# EAGLE schematic mini_robot (EAGLE 9.0.0)
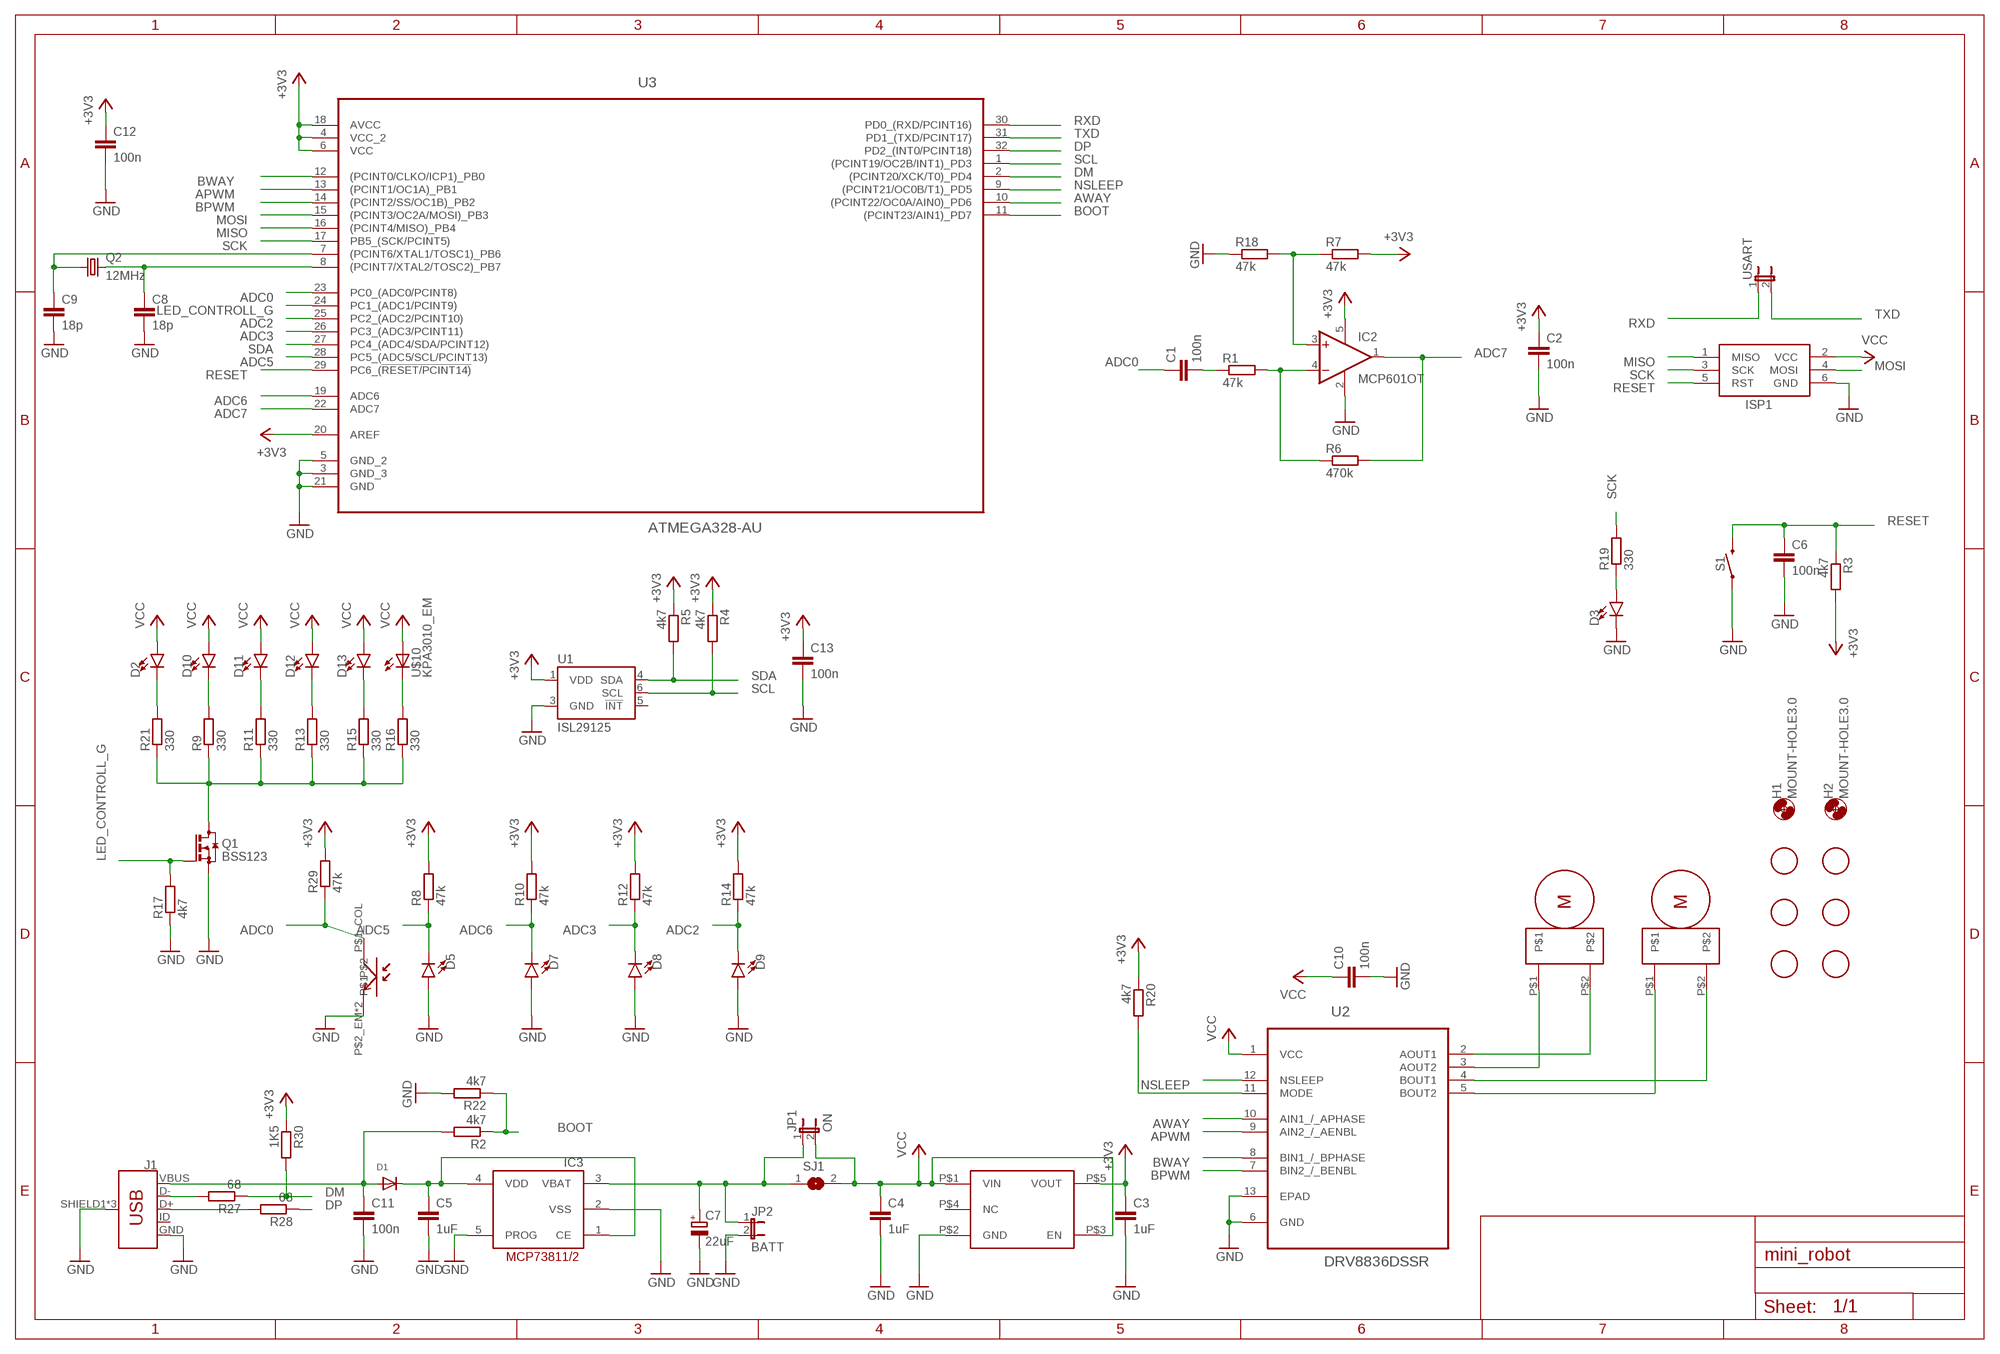
[diagram p0: schematic, sheet 1]

## Parts
C1  100n  C-EUC0603  [C0603]
C2  100n  C-EUC0603  [C0603]
C3  1uF  C-EUC0805  [C0805]
C4  1uF  C-EUC0805  [C0805]
C5  1uF  C-EUC0603  [C0603]
C6  100n  C-EUC0603  [C0603]
C7  22uF  CPOL-EU153CLV-0505  [153CLV-0505]
C8  18p  C-EUC0603  [C0603]
C9  18p  C-EUC0603  [C0603]
C10  100n  C-EUC0603  [C0603]
C11  100n  C-EUC0603  [C0603]
C12  100n  C-EUC0603  [C0603]
C13  100n  C-EUC0603  [C0603]
D1  DIODE_SOD-123FL  [SOD-123FL]
D2  LED-FKIT-1206  [FKIT-LED-1206]
D3  LED-FKIT-1206  [FKIT-LED-1206]
D5  LED-FKIT-1206  [FKIT-LED-1206]
D7  LED-FKIT-1206  [FKIT-LED-1206]
D8  LED-FKIT-1206  [FKIT-LED-1206]
D9  LED-FKIT-1206  [FKIT-LED-1206]
D10  LED-FKIT-1206  [FKIT-LED-1206]
D11  LED-FKIT-1206  [FKIT-LED-1206]
D12  LED-FKIT-1206  [FKIT-LED-1206]
D13  LED-FKIT-1206  [FKIT-LED-1206]
H1  MOUNT-HOLE3.0  [3,0]
H2  MOUNT-HOLE3.0  [3,0]
IC2  MCP601OT  [SOT23-5]
IC3  MCP73811/2  [SOT23-5L]
ISP1  AVRISP-6  [AVRISP]
J1  USB_MICRO-B_FEMALE-SMT  [USB-B-MICRO-SMD]
JP1  ON  JP1E  [JP1]
JP2  BATT  JP1E  [JP1]
Q1  BSS123  [SOT23]
Q2  12MHz  CRYSTALCTS406  [CTS406]
R1  47k  R-EU_R0603  [R0603]
R2  4k7  R-EU_R0603  [R0603]
R3  4k7  R-EU_R0603  [R0603]
R4  4k7  R-EU_R0603  [R0603]
R5  4k7  R-EU_R0603  [R0603]
R6  470k  R-EU_R0603  [R0603]
R7  47k  R-EU_R0603  [R0603]
R8  47k  R-EU_R0603  [R0603]
R9  330  R-EU_R0603  [R0603]
R10  47k  R-EU_R0603  [R0603]
R11  330  R-EU_R0603  [R0603]
R12  47k  R-EU_R0603  [R0603]
R13  330  R-EU_R0603  [R0603]
R14  47k  R-EU_R0603  [R0603]
R15  330  R-EU_R0603  [R0603]
R16  330  R-EU_R0603  [R0603]
R17  4k7  R-EU_R0603  [R0603]
R18  47k  R-EU_R0603  [R0603]
R19  330  R-EU_R0603  [R0603]
R20  4k7  R-EU_R0603  [R0603]
R21  330  R-EU_R0603  [R0603]
R22  4k7  R-EU_R0603  [R0603]
R27  68  R-EU_R0603  [R0603]
R28  68  R-EU_R0603  [R0603]
R29  47k  R-EU_R0603  [R0603]
R30  1K5  R-EU_R0603  [R0603]
S1  MOMENTARY-SWITCH-SPST-SMD-6.2MM-TALL  [TACTILE_SWITCH_SMD_6.2MM_TALL]
SJ1  SJ  [SJ]
U1  ISL29125  [ODFN-LD-6]
U2  DRV8836DSSR  [SON50P200X300X80-13N]
U3  ATMEGA328-AU  [QFP80P900X900X120-32N]
U$1  FIDUCIAL  [FIDUCIAL_1MM]
U$2  KPA3010  [KPA3010]
U$3  FIDUCIAL  [FIDUCIAL_1MM]
U$4  FIDUCIAL  [FIDUCIAL_1MM]
U$5  FIDUCIAL  [FIDUCIAL_1MM]
U$6  FIDUCIAL  [FIDUCIAL_1MM]
U$7  FIDUCIAL  [FIDUCIAL_1MM]
U$8  PLANETARY_GEAR_MOTOR  [PLANETARY_GEAR_MOTOR]
U$9  PLANETARY_GEAR_MOTOR  [PLANETARY_GEAR_MOTOR]
U$10  KPA3010_EM  [KPA3010]
U$11  MIC5504-3.3Y  [SOT23-5]
USART  JP1E  [JP1]

## Nets
+3V3: C2.1 C3.1 C12.1 C13.1 IC2.5(V+) R3.2 R4.1 R5.1 R7.2 R8.2 R10.2 R12.2 R14.2 R20.1 R29.2 R30.1 U1.1(VDD) U3.4(VCC_2) U3.6(VCC) U3.18(AVCC) U3.20(AREF) U$11.P$5(VOUT)
ADC0: C1.1 R29.1 U3.23(PC0_(ADC0/PCINT8)) U$2.P$1_COL
ADC2: D9.C R14.1 U3.25(PC2_(ADC2/PCINT10))
ADC3: D8.C R12.1 U3.26(PC3_(ADC3/PCINT11))
ADC5: D5.C R8.1 U3.28(PC5_(ADC5/SCL/PCINT13))
ADC6: D7.C R10.1 U3.19(ADC6)
ADC7: IC2.1(OUT) R6.2 U3.22(ADC7)
APWM: U2.9(AIN2_/_AENBL) U3.13((PCINT1/OC1A)_PB1)
AWAY: U2.10(AIN1_/_APHASE) U3.10((PCINT22/OC0A/AIN0)_PD6)
BOOT: R2.1 R22.1 U3.11((PCINT23/AIN1)_PD7)
BPWM: U2.7(BIN2_/_BENBL) U3.14((PCINT2/SS/OC1B)_PB2)
BWAY: U2.8(BIN1_/_BPHASE) U3.12((PCINT0/CLKO/ICP1)_PB0)
DM: R27.1 R30.2 U3.2((PCINT20/XCK/T0)_PD4)
DP: R28.1 U3.32(PD2_(INT0/PCINT18))
GND: C2.2 C3.2 C4.2 C5.2 C6.2 C7.- C8.2 C9.2 C10.2 C11.2 C12.2 C13.2 D3.C D5.A D7.A D8.A D9.A IC2.2(V-) IC3.2(VSS) IC3.5(PROG) ISP1.6(GND) J1.GND J1.SHIELD1(SHIELD) J1.SHIELD2(SHIELD) J1.SHIELD3(SHIELD) JP2.2 Q1.2(S) R17.1 R18.1 R22.2 S1.A2 U1.3(GND) U2.6(GND) U2.13(EPAD) U3.3(GND_3) U3.5(GND_2) U3.21(GND) U$2.P$2_EM U$2.P$3-NC U$11.P$2(GND)
LED_CONTROLL: Q1.3(D) R9.1 R11.1 R13.1 R15.1 R16.1 R21.1
LED_CONTROLL_G: Q1.1(G) R17.2 U3.24(PC1_(ADC1/PCINT9))
MISO: ISP1.1(MISO) U3.16((PCINT4/MISO)_PB4)
MOSI: ISP1.4(MOSI) U3.15((PCINT3/OC2A/MOSI)_PB3)
N$1: U2.2(AOUT1) U$8.P$2
N$2: U2.3(AOUT2) U$8.P$1
N$3: U2.4(BOUT1) U$9.P$2
N$4: U2.5(BOUT2) U$9.P$1
N$5: C11.1 D1.A J1.VBUS R2.2
N$6: C5.1 D1.C IC3.1(CE) IC3.4(VDD)
N$7: C1.2 R1.1
N$9: C7.+ IC3.3(VBAT) JP1.1 JP2.1 SJ1.1
N$10: R20.2 U2.11(MODE)
N$11: D10.C R9.2
N$12: D11.C R11.2
N$13: D12.C R13.2
N$14: D13.C R15.2
N$16: R16.2 U$10.P$1_COL(C)
N$17: C8.1 Q2.3 U3.8((PCINT7/XTAL2/TOSC2)_PB7)
N$18: C9.1 Q2.1 U3.7((PCINT6/XTAL1/TOSC1)_PB6)
N$19: D3.A R19.1
N$20: IC2.3(+IN) R7.1 R18.2
N$21: IC2.4(-IN) R1.2 R6.1
N$22: D2.C R21.2
N$23: J1.D- R27.2
N$24: J1.D+ R28.2
NSLEEP: U2.12(NSLEEP) U3.9((PCINT21/OC0B/T1)_PD5)
RESET: C6.1 ISP1.5(RST) R3.1 S1.B2 U3.29(PC6_(!RESET/PCINT14))
RXD: U3.30(PD0_(RXD/PCINT16)) USART.1
SCK: ISP1.3(SCK) R19.2 U3.17(PB5_(SCK/PCINT5))
SCL: R4.2 U1.6(SCL) U3.1((PCINT19/OC2B/INT1)_PD3)
SDA: R5.2 U1.4(SDA) U3.27(PC4_(ADC4/SDA/PCINT12))
TXD: U3.31(PD1_(TXD/PCINT17)) USART.2
VCC: C4.1 C10.1 D2.A D10.A D11.A D12.A D13.A ISP1.2(VCC) JP1.2 SJ1.2 U2.1(VCC) U$10.P$2_EM(A) U$10.P$3-NC(A) U$11.P$1(VIN) U$11.P$3(EN)
Unconnected: J1.ID U1.5(!INT) U$11.P$4(NC)

## Library data of the parts
C1-C6 C8-C13 = resistor:C-EU: CAPACITOR, European symbol
C7 = resistor:CPOL-EU: POLARIZED CAPACITOR, European symbol
D1 = adafruit:DIODE: Diode SMADIODE - SMA Surface Mount Package 20V 1A Schottky Diode Digikey: 641-1014-6-ND DO-1N4148 - Through Hole Small Current Diode SOD-123 20V 1 A (.5mV Vf) Schottky Diode - Digikey: MBRX120TPMSCT-ND SOD-323 10V 570mA (.38mV Vf, 3ns) Schottky Diode - Digikey: ZLLS410CT-ND SOD-523 30V 30mA Schottky Diode (RB751S-40TE61) - Digikey: RB751S-40TE61CT-ND SOT23-R/W - SOT23 Package (R = Solder Paste/Reflow Ovens, W = Hand-Soldering) BAT54Film 40V 300mA - Digikey: 497-7162-1-ND
D2 D3 D5 D7-D13 = SparkFun-LED:LED: LED (Generic) Standard schematic elements and footprints for 5mm, 3mm, 1206, and 0603 sized LEDs. Generic LEDs with no color specified.
H1 H2 = holes:MOUNT-HOLE: MOUNTING HOLE with drill center marker
IC2 = linear:MCP601: Single Op Amp 2.7V to 6.0V Single Supply CMOS Source: http://ww1.microchip.com/downloads/en/DeviceDoc/21314g.pdf
IC3 = adafruit:MCP73811/2: MCP73811 and MCP73812 Simple, Miniature Single-Cell, Fully Integrated Li-Ion / Li-Polymer Charge Management Controllers SOT-23-5 package, no indicator LED but with adjustable current, small and very inexpensive
ISP1 = adafruit:AVRISP: AVR ISP HEADER Standard 6 pin header for AVR programming
J1 = SparkFun-Connectors:USB_MICRO-B: USB Type Micro-B Connector Male/female and PTH/SMT variants SparkFun Products: SparkFun microB USB Breakout <https://www.sparkfun.com/products/12035> SparkFun USB microB Plug Breakout <https://www.sparkfun.com/products/10031> SparkFun ESP8266 Thing <https://www.sparkfun.com/products/13231>; PROD_ID: CONN-11752
JP1 JP2 USART = jumper:JP1E: JUMPER
Q1 = transistor-small-signal:BSS123: N-CHANNEL MOS FET
Q2 = adafruit:CRYSTAL: CRYSTAL; OC_FARNELL: unknown; OC_NEWARK: unknown
R1-R22 R27-R30 = resistor:R-EU_: RESISTOR, European symbol
S1 = SparkFun-Switches:MOMENTARY-SWITCH-SPST: Momentary Switch (Pushbutton) - SPST Normally-open (NO) SPST momentary switches (buttons, pushbuttons). Variants PTH-12MM - 12mm square, through-hole Momentary Pushbutton Switch - 12mm Square <https://www.sparkfun.com/products/9190> (COM-09190) PTH-6.0MM, PTH-6.0MM-KIT - 6.0mm square, through-hole Mini Pushbutton Switch <https://www.sparkfun.com/products/97> (COM-00097) KIT package intended for soldering kit's - only one side of pads' copper is exposed. PTH-RIGHT-ANGLE-KIT - Right-angle, through-hole Right Angle Tactile Button <https://www.sparkfun.com/products/10791> - Used on SparkFun BigTime Watch Kit <https://www.sparkfun.com/products/11734> SMD-12MM - 12mm square, surface-mount Tactile Button - SMD (12mm) <https://www.sparkfun.com/products/12993> (COM-12993) Used on SparkFun PicoBoard <https://www.sparkfun.com/products/11888> SMD-4.5MM - 4.5mm Square Trackball Switch Used on SparkFun Blackberry Trackballer Breakout <https://www.sparkfun.com/products/13169> SMD-4.6MMX2.8MM - 4.60mm x 2.80mm, surface mount Used on SparkFun SAMD21 Mini Breakout <https://www.sparkfun.com/products/13664> SMD-5.2MM, SMD-5.2-REDUNDANT - 5.2mm square, surface-mount Mini Pushbutton Switch - SMD <https://www.sparkfun.com/products/8720> (COM-08720) Used on Arduino Pro Mini <https://www.sparkfun.com/products/11114> REDUNDANT package connects both switch circuits together SMD-6.0X3.5MM - 6.0 x 3.5mm, surface mount Momentary Reset Switch SMD <https://www.sparkfun.com/products/8229> (COM-08229) SMD-6.2MM-TALL - 6.2mm square, surface mount Tactile Button - SMD (6mm) <https://www.sparkfun.com/products/12992> Used on SparkFun Digital Sandbox <https://www.sparkfun.com/products/12651> SMD-RIGHT-ANGLE - Right-angle, surface mount Used on SparkFun Block for Intel® Edison - Arduino <https://www.sparkfun.com/products/13036>; PROD_ID: SWCH-11966; SF_SKU: COM-12992
SJ1 = jumper:SJ: SMD solder JUMPER
U1 = SparkFun-Sensors:ISL29125: The ISL29125 is a low power, high sensitivity RGB color light sensor with an I2C interface.
U2 = my_parts:DRV8836DSSR: DUAL LOW VOLTAGE H-BRIDGE IC,SON-12; MPN: DRV8836DSSR; OC_FARNELL: 2115236; OC_NEWARK: 94T6066; PACKAGE: SON-12; SUPPLIER: TEXAS INSTRUMENTS
U3 = my_parts:ATMEGA328-AU: MCU, 8BIT, AVR, 32K FLASH, TQFP-32; MPN: ATMEGA328-AU; OC_FARNELL: 1972086; OC_NEWARK: 68T2926; PACKAGE: TQFP-32; SUPPLIER: ATMEL
U$1 U$3-U$7 = adafruit:FIDUCIAL: For use by pick and place machines to calibrate the vision/machine, 1mm By microbuilder.eu
U$2 = my_parts:KPA3010
U$8 U$9 = my_parts:PLANETARY_GEAR_MOTOR
U$10 = my_parts:KPA3010_EM
U$11 = my_parts:MIC5504-3.3Y